# EasyEDA Pro project ProProject_AmaizeTrack.epro, board AmaizePCB_2
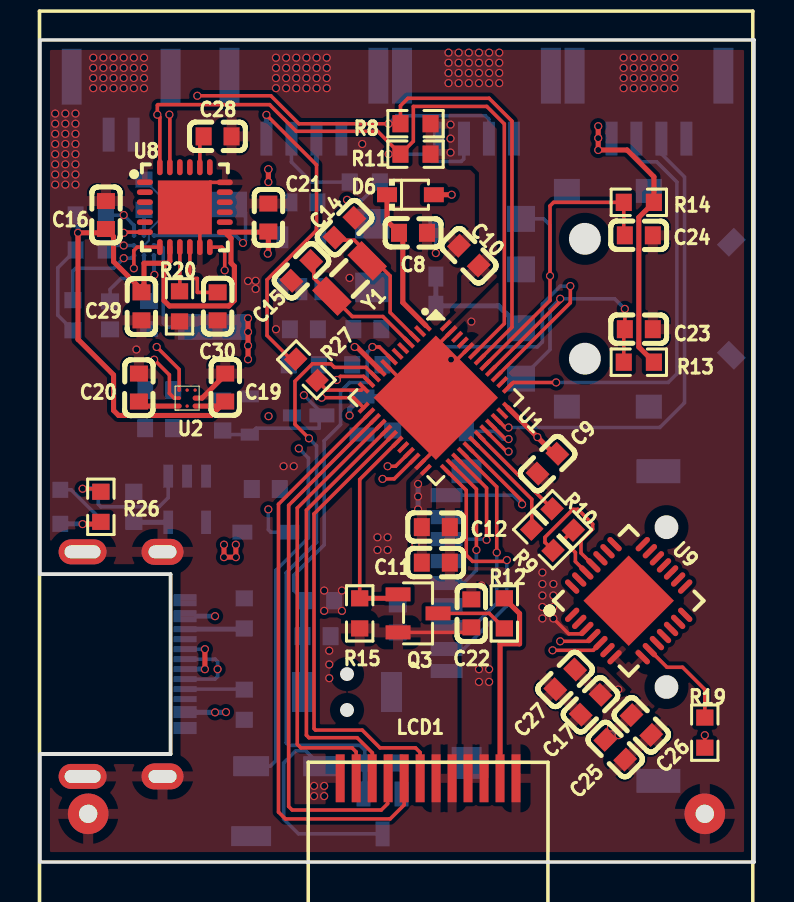
[diagram p6: board, top side]
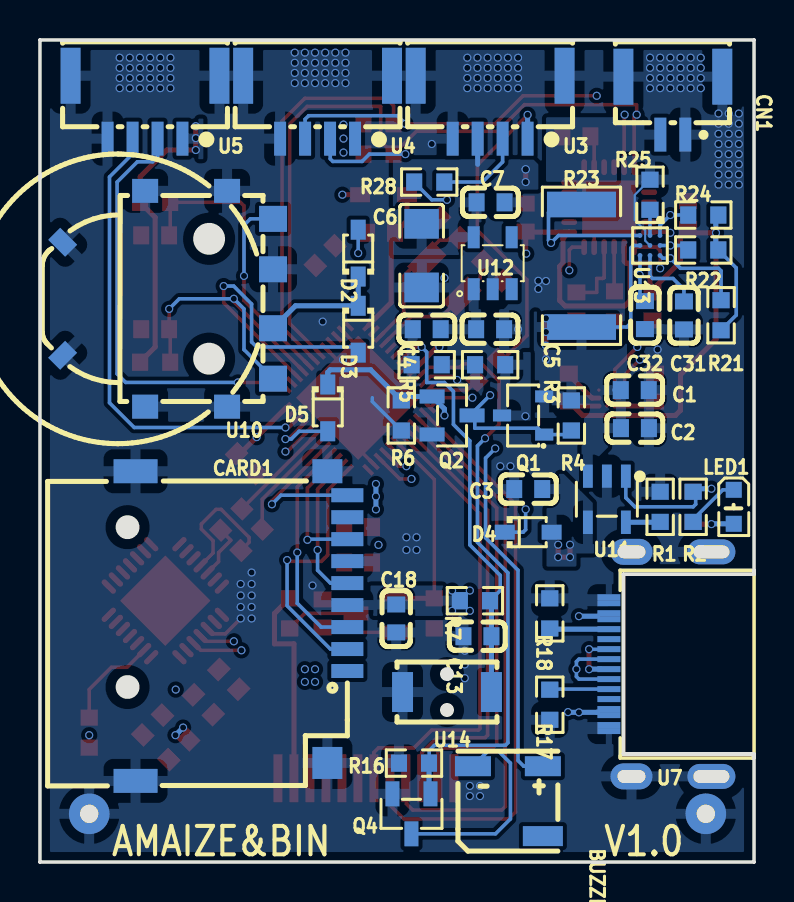
[diagram p7: board, bottom side, seen from below]

Outline 35.74 x 41.15 mm; copper layers: Top Layer, Inner1, Inner2, Bottom Layer. Coordinates in mm from the lower left corner of the outline.
Outline path: 0,41.15 0,14.41 6.54,14.41 6.54,5.41 0,5.41 0,0 35.74,0 35.74,41.15 0,41.15
Stack: Top Layer 0.035mm 外层铜厚1oz / Dielectric1 0.2104mm 7628 RC49% 8.6mil / Inner1 0.0152mm 内层铜厚 / Dielectric2 1.065mm 1.1mm H/HOZ 含铜 / Inner2 0.0152mm 内层铜厚 / Dielectric3 0.2104mm 7628 RC49% 8.6mil / Bottom Layer 0.035mm 外层铜厚1oz

## Design rules (mm)
template: 自定义配置
spacing copperThickness1oz (default): track to track 0.102, other pairs 0.051 to 0.3
spacing copperThickness2oz: track to track 0.203, other pairs 0.152 to 0.3
spacing copperThicknessInner0.5oz: track to track 0.089, other pairs 0.152 to 0.3
track width copperThickness1oz (default): min 0.102, default 0.254, max 2.54
track width copperThickness2oz: min 0.203, default 0.254, max 2.54
track width copperThickness0.5oz: min 0.089, default 0.254, max 2.54
differential pair differentialPair (default): width min 0.127, default 0.254, max 2.54; gap min 0.152, default 0.152
via viaSize (default): diameter min 0.3, default 0.61, max 10; hole min 0.201, default 0.305, max 6.299
net GND uses copperRegion1
net 3V3 uses copperRegion1
net BAT_IN uses copperRegion1
net BAT uses copperRegion1
net USB_VCC uses copperRegion1
net V33_CP2102 uses copperRegion1
net BAT_PACK+ uses copperRegion1

## Placement (name value [footprint] x y rotation side)
BUZZER1  4kHz  [BUZ-SMD_FST-5030]  12.32 3.05 0 bottom
C1  4.7uF  [C0603]  5.97 23.62 180 bottom
C2  100nF  [C0603]  5.96 21.72 180 bottom
C3  4.7uF  [C0603]  11.3 18.67 0 bottom
C4  100nF  [C0603]  16.38 26.67 0 bottom
C5  10uF  [C0603]  13.21 26.67 180 bottom
C6  22uF  [C1206]  16.64 30.35 270 bottom
C7  100nF  [C0603]  13.19 33.02 180 bottom
C8  100nF  [C0603]  18.67 31.5 180 top
C9  1uF  [C0603]  25.4 19.94 225 top
C10  1uF  [C0603]  21.46 30.35 135 top
C11  1uF  [C0603]  19.81 14.99 0 top
C12  1uF  [C0603]  19.81 16.76 0 top
C13  100nF  [C0603]  13.84 11.3 180 bottom
C14  22pF  [C0603]  15.24 31.75 225 top
C15  22pF  [C0603]  13.08 29.59 225 top
C16  1uF  [C0603]  3.3 32.39 270 top
C17  4.7uF  [C0603]  27.56 7.87 45 top
C18  100nF  [C0603]  17.91 12.19 90 bottom
C19  2.2uF  [C0603]  9.27 23.75 270 top
C20  4.7uF  [C0603]  4.95 23.75 90 top
C21  100nF  [C0603]  11.43 32.26 270 top
C22  100nF  [C0603]  21.59 12.45 90 top
C23  100nF  [C0603]  29.97 26.67 0 top
C24  100nF  [C0603]  29.97 31.37 0 top
C25  1uF  [C0603]  28.79 5.62 315 top
C26  100nF  [C0603]  30.1 6.86 315 top
C27  100nF  [C0603]  26.29 9.14 45 top
C28  2.2nF  [C0603]  8.89 36.32 0 top
C29  10nF  [C0603]  5.08 27.81 90 top
C30  100nF  [C0603]  8.89 27.81 270 top
C31  2.2uF  [C0603]  3.51 27.36 270 bottom
C32  1uF  [C0603]  5.46 27.38 90 bottom
CARD1  TF PUSH  [TF-SMD_TF-PUSH]  25.65 11.81 270 bottom
CN1  WAFER-GH1.25-2PWB  [CONN-TH_2P-P1.25_XUNPU_WAFER-GH1.25-2PWB]  4.06 37.86 0 bottom
D2  1N4148WS  [SOD-323_L1.8-W1.3-LS2.5-RD]  19.81 30.48 90 bottom
D3  1N4148WS  [SOD-323_L1.8-W1.3-LS2.5-RD]  19.81 26.67 270 bottom
D4  1N4148WS  [SOD-323_L1.8-W1.3-LS2.5-RD]  11.3 16.51 180 bottom
D5  1N4148WS  [SOD-323_L1.8-W1.3-LS2.5-RD]  21.34 22.73 270 bottom
D6  1N4007WS  [SOD-323_L1.8-W1.3-LS2.5-RD]  18.54 33.4 0 top
LCD1  SCREEN 2.0'  [SCREEN 2.0' 12PIN]  19.43 2.99 0 top
LED1  SZYY0603R  [LED0603-R-RD]  1.02 17.78 270 bottom
NOREF  -  [Pad_e650]  2.41 2.41 0 top
NOREF#2  -  [Pad_e649]  33.27 2.41 0 top
Q1  AO3401  [SOT-23-3_L2.9-W1.4-P1.90-LS2.6-BR]  11.56 22.35 180 bottom
Q2  AO3400  [SOT-23-3_L2.9-W1.3-P1.90-LS2.4-BR]  15.11 22.35 0 bottom
Q3  AO3400  [SOT-23-3_L2.9-W1.3-P1.90-LS2.4-BR]  18.92 12.45 180 top
Q4  AO3400  [SOT-23-3_L2.9-W1.3-P1.90-LS2.4-BR]  17.15 2.41 90 bottom
R1  2kΩ  [R0603]  4.7 17.78 90 bottom
R2  1kΩ  [R0603]  3.05 17.78 90 bottom
R3  20kΩ  [R0603]  13.21 24.89 0 bottom
R4  20kΩ  [R0603]  9.14 22.35 270 bottom
R5  20kΩ  [R0603]  16.38 24.89 0 bottom
R6  20kΩ  [R0603]  17.65 22.35 90 bottom
R7  10kΩ  [R0603]  13.97 13.08 180 bottom
R8  10kΩ  [R0603]  18.8 36.96 180 top
R9  100Ω  [R0603]  25.15 16.13 315 top
R10  100Ω  [R0603]  26.16 17.14 315 top
R11  10kΩ  [R0603]  18.8 35.43 180 top
R12  10Ω  [R0603]  23.24 12.45 270 top
R13  10kΩ  [R0603]  29.97 25.02 180 top
R14  10kΩ  [R0603]  29.97 33.02 180 top
R15  10kΩ  [R0603]  16 12.45 270 top
R16  10kΩ  [R0603]  17.02 4.95 0 bottom
R17  5.1kΩ  [R0603]  10.22 7.87 90 bottom
R18  5.1kΩ  [R0603]  10.22 12.45 270 bottom
R19  10kΩ  [R0603]  33.27 6.48 270 top
R20  10kΩ  [R0603]  6.99 27.81 90 top
R21  10kΩ  [R0603]  1.65 27.37 90 bottom
R22  10kΩ  [R0603]  2.54 30.64 0 bottom
R23  0Ω  [R2512]  8.64 29.84 270 bottom
R24  10kΩ  [R0603]  2.54 32.39 180 bottom
R25  SDNT1608X103F3380FTF  [R0603]  5.21 33.4 90 bottom
R26  10kΩ  [R0603]  3.05 17.78 90 top
R27  100Ω  [R0603]  13.34 24.64 315 top
R28  100Ω  [R0603]  16.26 34.04 0 bottom
U1  AT32F403ACGU7  [QFN-48_L6.0-W6.0-P0.40-BL-EP4.2]  19.81 23.24 225 top
U2  QMC6310U  [LGA-8_L1.2-W1.2-P0.40-R3-C3-TL]  7.37 23.22 180 top
U3  WAFER-GH1.25-4PWB  [CONN-SMD_4P-P1.25_XUNPU_WAFER-GH1.25-4PWB]  13.21 37.78 0 bottom
U4  WAFER-GH1.25-4PWB  [CONN-SMD_4P-P1.25_XUNPU_WAFER-GH1.25-4PWB]  21.84 37.78 0 bottom
U5  WAFER-GH1.25-4PWB  [CONN-SMD_4P-P1.25_XUNPU_WAFER-GH1.25-4PWB]  30.48 37.78 0 bottom
U7  USB-TYPE-C-016  [USB-SMD_TYPE-C16PCB1.6073]  4.7 9.91 90 bottom
U8  MPU-6050  [QFN-24_L4.0-W4.0-P0.50-BL-EP2.7]  7.25 32.78 270 top
U9  CP2102-GMR  [WQFN-28_L5.0-W5.0-P0.50-BL-EP3.2]  29.46 13.08 315 top
U10  SIQ-02FVS3  [SW-SMD_SIQ-02FVS3_1]  29.34 28.19 90 bottom
U11  MCP73831T-2ACI/OT  [SOT-23-5_L3.0-W1.7-P0.95-LS2.8-BL]  7.37 18.16 0 bottom
U12  LP5907MFX-3.3/NOPB  [SOT-23-5_L3.0-W1.7-P0.95-LS2.8-BR]  13.08 29.97 270 bottom
U13  BQ27220YZFR  [DSBGA-9_L1.7-W1.6-R3-C3-P0.50-BL]  5.21 30.86 0 bottom
U14  ZX-QC34-2TPDZ  [KEY-SMD_L3.9-W3.0-LS5.0-EH]  15.37 8.51 180 bottom
Y1  32.768kHz  [FC-135R_L3.2-W1.5]  15.49 29.21 225 top

## Footprints (pads in the part's own frame, mm; a bottom-side part is the same pattern mirrored in y, then rotated)
BUZ-SMD_FST-5030
  rect 1.8x1 smd: 1(-1.75,-1.75) 2(1.75,-1.75)
  rect 2x1 smd: 3(-1.75,1.75)
C0603
  rect 0.8x0.9 smd: 1(-0.7,0) 2(0.7,0)
C1206
  rect 1.485x1.728 smd: 1(-1.593,0) 2(1.593,0)
CONN-SMD_4P-P1.25_XUNPU_WAFER-GH1.25-4PWB
  rect 0.6x1.7 smd: 1(1.875,1.575) 2(0.625,1.575) 3(-0.625,1.575) 4(-1.875,1.575)
  rect 1x2.8 smd: 5(3.725,-1.575) 6(-3.725,-1.575)
CONN-TH_2P-P1.25_XUNPU_WAFER-GH1.25-2PWB
  rect 0.6x1.7 smd: 1(-0.625,1.45) 2(0.625,1.45)
  rect 1x2.8 smd: 3(-2.475,-1.45) 4(2.475,-1.45)
DSBGA-9_L1.7-W1.6-R3-C3-P0.50-BL
  round 0.24 smd: A1(-0.5,-0.5) A2(-0.5,0) A3(-0.5,0.5) B1(0,-0.5) B2(0,0) B3(0,0.5) C1(0.5,-0.5) C2(0.5,0) C3(0.5,0.5)
FC-135R_L3.2-W1.5
  rect 1x1.8 smd: 1(-1.25,0) 2(1.25,0)
KEY-SMD_L3.9-W3.0-LS5.0-EH
  rect 1.05x2 smd: 1(-2.225,0) 2(2.225,0)
LED0603-R-RD
  rect 0.8x0.8 smd: 1(0.851,0) 2(-0.851,0)
LGA-8_L1.2-W1.2-P0.40-R3-C3-TL
  round 0.17 smd: A1(-0.4,0.4) A2(0,0.4) A3(0.4,0.4) B1(-0.4,0) B3(0.4,0) C1(-0.4,-0.4) C2(0,-0.4) C3(0.4,-0.4)
Pad_e649
  round 2.032 hole 0.914: 50(0,0)
Pad_e650
  round 2.032 hole 0.914: 51(0,0)
QFN-24_L4.0-W4.0-P0.50-BL-EP2.7
  oval 0.28x0.8 smd: 1(-1.25,-2) 2(-0.75,-2) 3(-0.25,-2) 4(0.25,-2) 5(0.75,-2) 6(1.25,-2) 13(1.25,2) 14(0.75,2) 15(0.25,2) 16(-0.25,2) 17(-0.75,2) 18(-1.242,2)
  oval 0.8x0.28 smd: 7(2,-1.25) 8(2,-0.75) 9(2,-0.25) 10(2,0.25) 11(2,0.75) 12(2,1.25) 19(-2,1.25) 20(-2,0.75) 21(-2,0.25) 22(-2,-0.25) 23(-2,-0.75) 24(-2,-1.25)
  rect 2.7x2.7 smd: 25(0.013,0)
QFN-48_L6.0-W6.0-P0.40-BL-EP4.2
  rect 0.2x0.665 smd: 1(-2.2,-2.908) 2(-1.8,-2.908) 3(-1.4,-2.907) 4(-1,-2.908) 5(-0.6,-2.908) 6(-0.2,-2.908) 7(0.2,-2.908) 8(0.6,-2.908) 9(1,-2.908) 10(1.4,-2.907) 11(1.8,-2.908) 12(2.2,-2.908) 25(2.2,2.908) 26(1.8,2.908) 27(1.4,2.907) 28(1,2.908) 29(0.6,2.908) 30(0.2,2.908) 31(-0.2,2.908) 32(-0.6,2.908) 33(-1,2.908) 34(-1.4,2.907) 35(-1.8,2.908) 36(-2.2,2.908)
  rect 0.665x0.2 smd: 13(2.908,-2.2) 14(2.908,-1.8) 15(2.907,-1.4) 16(2.908,-1) 17(2.908,-0.6) 18(2.908,-0.2) 19(2.908,0.2) 20(2.908,0.6) 21(2.908,1) 22(2.907,1.4) 23(2.908,1.8) 24(2.908,2.2) 37(-2.908,2.2) 38(-2.908,1.8) 39(-2.907,1.4) 40(-2.908,1) 41(-2.908,0.6) 42(-2.908,0.2) 43(-2.908,-0.2) 44(-2.908,-0.6) 45(-2.908,-1) 46(-2.907,-1.4) 47(-2.908,-1.8) 48(-2.908,-2.2)
  rect 4.4x4.4 smd: 49(0,0)
R0603
  rect 0.806x0.864 smd: 1(-0.753,0) 2(0.753,0)
R2512
  rect 1.282x3.456 smd: 1(-3.067,0) 2(3.067,0)
SCREEN 2.0' 12PIN
  rect 0.45x2.4 smd: 1(4.4,1.2) 2(3.6,1.2) 3(2.8,1.2) 4(2,1.2) 5(1.2,1.2) 6(0.4,1.2) 7(-0.4,1.2) 8(-1.2,1.2) 9(-2,1.2) 10(-2.8,1.2) 11(-3.6,1.2) 12(-4.4,1.2)
SOD-323_L1.8-W1.3-LS2.5-RD
  rect 1x0.75 smd: 1(-1.173,0) 2(1.173,0)
SOT-23-3_L2.9-W1.3-P1.90-LS2.4-BR
  rect 1.25x0.7 smd: 1(1,-0.95) 2(1,0.95) 3(-1,0)
SOT-23-3_L2.9-W1.4-P1.90-LS2.6-BR
  rect 0.91x0.6 smd: 1(1.055,-0.955) 2(1.055,0.955) 3(-1.055,0)
SOT-23-5_L3.0-W1.7-P0.95-LS2.8-BL
  rect 0.49x1.157 smd: 1(-0.95,-1.153) 2(0,-1.153) 3(0.95,-1.153)
  rect 0.49x1.175 smd: 4(0.95,1.153) 5(-0.95,1.153)
SOT-23-5_L3.0-W1.7-P0.95-LS2.8-BR
  rect 1.1x0.6 smd: 1(1.3,-0.95) 2(1.3,0) 3(1.3,0.95) 4(-1.3,0.95) 5(-1.3,-0.95)
SW-SMD_SIQ-02FVS3_1
  rect 1.2x1.3 smd: 1(5.4,-2.964) 2(5.4,1.136) 5(-5.4,1.136) 6(-5.4,-2.964)
  rect 0.85x1.2 smd rot 45: 3(2.829,5.264)
  rect 0.85x1.2 smd rot 135: 4(-2.829,5.264)
  rect 1.3x1.4 smd: A(-4,-5.264) B(4,-5.264) C(1.475,-5.264) S(-1.475,-5.264)
TF-SMD_TF-PUSH
  rect 0.7x1.6 smd: 1(2.25,5.3) 2(1.15,5.3) 3(0.05,5.3) 4(-1.05,5.3) 5(-2.15,5.3) 6(-3.25,5.3) 7(-4.35,5.3) 8(-5.45,5.3) 9(-6.55,5.3)
  rect 1.2x1.5 smd: 10(-7.75,4.3)
  rect 1.2x2.2 smd: 11(-7.75,-5.3) 12(7.75,-5.3)
  rect 1.6x1.5 smd: 13(6.85,4.3)
USB-SMD_TYPE-C16PCB1.6073
  oval 1.25x2.4 hole 0.65x1.8: 17(-5.62,-2.566) 18(5.62,-2.566)
  oval 1.3x2.1 hole 0.65x1.4: 19(-5.62,1.435) 20(5.62,1.435)
  rect 0.3x1.15 smd: A1(-3.35,2.566) A4(-2.55,2.566) A5(-1.25,2.566) A6(-0.25,2.566) A7(0.25,2.566) A8(1.25,2.566) A9(2.55,2.566) A12(3.35,2.566) B1(3.05,2.566) B4(2.25,2.566) B5(1.75,2.566) B6(0.75,2.566) B7(-0.75,2.566) B8(-1.75,2.566) B9(-2.25,2.566) B12(-3.05,2.566)
WQFN-28_L5.0-W5.0-P0.50-BL-EP3.2
  oval 0.28x0.9 smd: 1(-1.502,-2.5) 2(-1.001,-2.5) 3(-0.5,-2.5) 4(0,-2.5) 5(0.5,-2.5) 6(1,-2.5) 7(1.501,-2.5) 15(1.501,2.5) 16(1,2.5) 17(0.5,2.5) 18(0,2.5) 19(-0.5,2.5) 20(-1.001,2.5) 21(-1.502,2.5)
  oval 0.9x0.28 smd: 8(2.5,-1.502) 9(2.5,-1.001) 10(2.5,-0.5) 11(2.5,0) 12(2.5,0.5) 13(2.5,1) 14(2.5,1.501) 22(-2.5,1.501) 23(-2.5,1) 24(-2.5,0.5) 25(-2.5,0) 26(-2.5,-0.5) 27(-2.5,-1.001) 28(-2.5,-1.502)
  rect 3.2x3.2 smd: 29(0,0)

## Nets
As in the schematic, except:
GND: C1.2 C2.2 C3.2 C4.2 C5.2 C6.2 C7.2 C8.1 C9.2 C10.2 C11.2 C12.2 C13.1 C14.1 C15.2 C16.1 C17.1 C18.1 C19.1 C20.2 C21.1 C22.1 C23.2 C24.2 C25.2 C26.2 C27.1 C28.2 C29.1 C30.2 C31.2 C32.1 CARD1.6 CARD1.10 CARD1.11 CARD1.12 CARD1.13 CN1.1 CN1.3 CN1.4 LCD1.1 LCD1.5 LCD1.6 LCD1.12 NOREF.51 NOREF#2.50 Q2.2 Q3.2 Q4.2 R1.2 R5.2 R6.1 R15.2 R16.2 R17.1 R18.1 R20.1 R25.2 U1.8 U1.23 U1.35 U1.44 U1.47 U1.49 U2.B1 U3.1 U3.5 U3.6 U4.1 U4.5 U4.6 U5.1 U5.5 U5.6 U7.17 U7.18 U7.19 U7.20 U7.A1 U7.A12 U7.B1 U7.B12 U8.1 U8.11 U8.18 U8.25 U9.3 U9.29 U10.1 U10.2 U10.3 U10.4 U10.5 U10.6 U10.C U11.2 U12.2 U13.B2 U14.1

Pads without a net: BUZZER1 3; CARD1 1 8; U1 2 5 6 20 38 45 46; U2 A2 C1 C2; U7 A8 B8; U8 2 3 4 5 14 15 16 17 19 21 22; U9 1 2 10 11 12 13 14 15 16 17 18 19 20 21 22 23 24 27 28; U12 4

## Via types
v1: diameter 0.406, hole 0.299, Top Layer to Bottom Layer, 242 vias

## Routing (per net, layer and track width the routed paths; a pad name or vN(x,y) marks a point on that pad's centre or on a via; arc(x,y) is an arc through that point)
3V3: length 97.1
  Top Layer w0.254: 5.08,28.65 5.08,28.78 5.21,28.91 5.21,29.97 6.21,29.97 ; 5.08,28.65 3.68,30.05 3.68,31.3 C16.2 3.11,31.5 v1(1.91,31.5) 1.91,26.16 3.68,24.38 3.68,22.61 3.94,22.35 8.57,22.35 9.05,22.82 ; 5.08,28.65 C29.2 ; 7.77,22.82 9.05,22.82 ; 9.05,22.82 C19.2 ; R13.1 30.73,25.03 29.97,25.78 29.97,32.27 R14.1 30.73,34.3 29.38,35.64 v1(27.94,35.64) v1(27.94,36.23) v1(27.94,36.83) ; U1.9 15.86,25.78 v1(15.75,25.78) ; U8.8 6.5,30.08 6.4,29.97 6.21,29.97 ; U1.36 v1(24.9,21.27) 25.73,20.43 C9.1 ; v1(11.4,30.45) 11.43,30.48 C21.2 11.4,31.53 U8.13 9.56,31.22 9.56,29.98 9.73,29.82 9.73,28.11 9.46,27.83 6.48,27.83 6.21,28.1 6.21,29.97 ; v1(11.43,34.67) v1(11.43,34.04)
  Inner1 w0.254: v1(11.43,34.04) 11.43,30.48 v1(11.4,30.45) ; v1(24.9,21.27) 22.55,18.92 v1(18.92,18.92) ; v1(20.55,36.91) 19.61,37.85 14.6,37.85 v1(11.43,34.67)
  Inner2 w0.254: v1(15.75,25.78) 15.75,25.4 18.92,22.22 v1(18.92,18.92)
  Bottom Layer w0.178: R21.1 0.89,27.38 0.89,29.74 R22.1
  Bottom Layer w0.254: v1(18.92,17.65) v1(18.92,18.3) v1(18.92,18.92) ; 1.91,32.39 1.91,30.64 ; U3.2 13.83,34.92
  vias: v1(14.22,13.59) v1(14.22,12.57) v1(15.11,13.59) v1(15.11,12.57) v1(18.8,15.88) v1(20.55,36.21) v1(20.55,35.51) v1(21.97,9.65) v1(21.97,9.02) v1(22.1,13.84) v1(22.48,9.65) v1(22.48,9.02)
GND: length 31.6
  Top Layer w0.178: U1.47 19.81,25.79 19.81,24.09 ; Q3.2 21.34,11.5 C22.1 ; 21.44,25.72 19.81,24.09 ; 19.81,24.09 U1.49 ; U8.11 8,32.02 U8.25 8.51,34.02 U8.18 ; U1.49 18.96,23.24 17.33,24.87 ; U1.49 19.81,20.7 U1.23 ; U9.3 27.1,11.42 26.47,11.42 v1(25.69,12.19)
  Top Layer w0.254: 7.77,23.22 8.11,23.22 9.27,24.38 C19.1
  Bottom Layer w0.102: R25.2 5.97,33.39 5.97,32.13 5.45,31.61 5.45,31.1 U13.B2
  Bottom Layer w0.178: 19.1,23.24 19.1,23.05 R6.1
  vias: v1(0.76,37.47) v1(0.76,36.96) v1(0.76,36.45) v1(0.76,35.94) v1(0.76,35.43) v1(0.76,34.92) v1(0.76,34.42) v1(0.76,33.91) v1(1.27,37.47) v1(1.27,36.96) v1(1.27,36.45) v1(1.27,35.94) v1(1.27,35.43) v1(1.27,34.92) v1(1.27,34.42) v1(1.27,33.91) v1(1.78,37.47) v1(1.78,36.96) v1(1.78,36.45) v1(1.78,35.94) v1(1.78,35.43) v1(1.78,34.92) v1(1.78,34.42) v1(1.78,33.91) v1(2.67,40.26) v1(2.67,39.75) v1(2.67,39.24) v1(2.67,38.73) v1(3.18,40.26) v1(3.18,39.75) v1(3.18,39.24) v1(3.18,38.73) v1(3.68,40.26) v1(3.68,39.75) v1(3.68,39.24) v1(3.68,38.73) v1(4.19,40.26) v1(4.19,39.75) v1(4.19,39.24) v1(4.19,38.73) v1(4.7,40.26) v1(4.7,39.75) v1(4.7,39.24) v1(4.7,38.73) v1(4.83,25.65) v1(5.21,40.26) v1(5.21,39.75) v1(5.21,39.24) v1(5.21,38.73) v1(10.41,29.08) v1(10.8,29.09) v1(10.8,28.69) v1(11.81,40.26) v1(11.81,39.75) v1(11.81,39.24) v1(11.81,38.73) v1(11.81,26.67) v1(12.19,19.81) v1(12.32,40.26) v1(12.32,39.75) v1(12.32,39.24) v1(12.32,38.73) v1(12.7,19.81) v1(12.83,40.26) v1(12.83,39.75) v1(12.83,39.24) v1(12.83,38.73) v1(13.34,40.26) v1(13.34,39.75) v1(13.34,39.24) v1(13.34,38.73) v1(13.72,3.81) v1(13.72,3.3) v1(13.84,40.26) v1(13.84,39.75) v1(13.84,39.24) v1(13.84,38.73) v1(14.22,3.81) v1(14.22,3.3) v1(14.35,40.26) v1(14.35,39.75) v1(14.35,39.24) v1(14.35,38.73) v1(14.48,10.58) v1(14.48,9.89) v1(14.48,9.2) v1(15.49,29.24) v1(16.13,35.94) v1(16.89,16.26) v1(16.89,15.62) v1(17.4,16.26) v1(17.4,15.62) v1(20.45,40.51) v1(20.45,40) v1(20.45,39.5) v1(20.45,38.99) v1(20.57,25.15) v1(20.96,40.51) v1(20.96,40) v1(20.96,39.5) v1(20.96,38.99) v1(21.46,40.51) v1(21.46,40) v1(21.46,39.5) v1(21.46,38.99) v1(21.59,27.05) v1(21.97,40.51) v1(21.97,40) v1(21.97,39.5) v1(21.97,38.99) v1(22.48,40.51) v1(22.48,40) v1(22.48,39.5) v1(22.48,38.99) v1(22.99,40.51) v1(22.99,40) v1(22.99,39.5) v1(22.99,38.99) v1(25.15,14.49) v1(25.15,13.92) v1(25.15,13.34) v1(25.15,12.77) v1(25.15,12.19) v1(25.69,13.92) v1(25.69,13.34) v1(25.69,12.77) v1(29.21,40.26) v1(29.21,39.75) v1(29.21,39.24) v1(29.21,38.73) v1(29.72,40.26) v1(29.72,39.75) v1(29.72,39.24) v1(29.72,38.73) v1(30.23,40.26) v1(30.23,39.75) v1(30.23,39.24) v1(30.23,38.73) v1(30.73,40.26) v1(30.73,39.75) v1(30.73,39.24) v1(30.73,38.73) v1(31.24,40.26) v1(31.24,39.75) v1(31.24,39.24) v1(31.24,38.73) v1(31.75,40.26) v1(31.75,39.75) v1(31.75,39.24) v1(31.75,38.73)
V33_CP2102: length 5.9
  Top Layer w0.178: v1(33.27,6.35) R19.2
  Inner2 w0.178: v1(33.27,6.35) 31.23,6.35 v1(28.94,8.63)
VBAT: length 7.4
  Top Layer w0.254: U1.1 18.16,28 18.16,31.3 C8.2 17.37,32.1 D6.1
VDD_GAUGE: length 3.6
  Bottom Layer w0.178: U13.B3 5.21,29.34 5.08,29.21 4.06,29.21 3.51,28.66 C31.1
AUX_CL: length 11.6
  Top Layer w0.178: U2.B3 6.71,23.22 6.48,23.46 6.48,24.38 v1(5.72,25.15) ; v1(4.7,29.72) 4.7,30.61 4.87,30.78 U8.7
  Inner1 w0.178: v1(5.72,25.15) 6.48,25.15 6.6,25.27 6.6,25.65 4.06,28.19 4.06,29.08 v1(4.7,29.72)
AUX_DA: length 10.5
  Top Layer w0.178: v1(4.19,31.5) 4.22,31.53 U8.6 ; U2.C3 6.97,24.66 v1(5.84,25.78)
  Inner1 w0.178: v1(5.84,25.78) 3.68,27.94 3.68,30.99 v1(4.19,31.5)
BAT: length 20.1
  Inner1 w0.178: v1(12.95,20.7) 12.95,20.8 v1(11.44,22.32)
  Bottom Layer w0.178: BUZZER1.1 11.53,4.8 11.81,5.08 11.81,14.61 13.44,16.23 13.44,20.22 v1(12.95,20.7)
BAT_CHG_DET: length 32.7
  Top Layer w0.178: R26.2 2.9,18.69 v1(2.13,18.69) ; U1.32 23.36,20.54 23.49,20.54
  Inner1 w0.178: v1(23.45,20.54) 22.38,19.47 18.71,19.47 15.84,16.6 4.22,16.6 v1(2.13,18.69)
  Bottom Layer w0.178: U11.1 6.42,18.23 5.96,17.78 3.05,17.78 2.92,17.91 2.92,18.53
  Bottom Layer w0.254: v1(2.13,18.69) 2.77,18.69 2.92,18.53
BAT_DET: length 1.8
  Top Layer w0.178: v1(14.86,24.13) 15.04,24.31 16.2,24.31 U1.11
BAT_IN: length 26.4
  Top Layer w0.254: v1(10.41,25.17) v1(10.41,25.85) v1(10.41,26.53) v1(10.41,27.22) ; D6.2 v1(20.6,33.4)
  Inner2 w0.178: v1(10.41,27.22) 20.23,27.22 20.57,27.56 20.57,33.37 v1(20.6,33.4)
  Bottom Layer w0.178: R23.2 6.37,26.78 6.17,26.98 6.17,30.73 6.04,30.86 U13.C2
  Bottom Layer w0.254: 6.97,23.62 6.66,23.31
BAT_PACK+: length 15.5
  Inner1 w0.178: v1(5.73,29.39) 7.8,29.39 9.4,30.99 v1(10.16,30.99)
  Bottom Layer w0.178: U13.C3 5.71,28.32 C32.2 ; U13.C1 9.79,31.36 v1(10.16,30.99) 10.29,31.11 10.29,32.51 9.89,32.91 R23.1
BUZZ: length 30.1
  Top Layer w0.178: 16.77,24.31 16.31,24.76 14.74,24.76 14.56,24.94 13.63,24.94 12.76,24.07 12.76,21.91 v1(13.46,21.21)
  Bottom Layer w0.178: v1(13.46,21.21) 13.84,20.83 13.84,16 12.32,14.48 12.32,5.97 12.45,5.84 16,5.84 16.26,5.59 16.26,4.96 R16.1
  Bottom Layer w0.254: Q4.1 16.26,3.48 R16.1
D+: length 25.3
  Top Layer w0.178: U9.4 27.43,11.05 v1(26.03,11.05)
  Top Layer w0.254: v1(8.25,9.65) v1(8.25,10.66)
  Inner1 w0.178: v1(8.25,10.66) 8.5,10.41 11.43,10.41 15.24,6.6 20.7,6.6 25.15,11.05 v1(26.03,11.05)
  Bottom Layer w0.178: v1(8.25,10.66) 8.25,10.65 7.65,10.65 7.65,10.66
  Bottom Layer w0.254: 7.65,9.66 8.25,9.66 v1(8.25,9.65)
D-: length 26.1
  Top Layer w0.178: 28.05,10.96 27.69,10.6 v1(25.65,10.6)
  Inner1 w0.178: v1(8.89,9.65) 9.14,9.91 11.18,9.91 14.86,6.22 21.03,6.22 25.4,10.6 v1(25.65,10.6)
  Bottom Layer w0.178: 7.65,9.16 8.76,9.16 8.89,9.28 v1(8.89,9.65) 8.89,10.03 8.76,10.16 7.65,10.16
EC_A: length 15.9
  Top Layer w0.178: v1(26.03,28.19) 26.03,28.05 U1.40 ; R13.2 29.22,26.62 C23.1 29.27,27.69
  Bottom Layer w0.178: v1(29.27,27.69) 28.76,28.19 v1(26.03,28.19) 25.53,27.69 25.53,25.65 24.32,24.45 24.07,24.45
EC_B: length 18.9
  Top Layer w0.178: C24.1 29.22,31.42 R14.2 25.71,33.02 25.53,32.84 v1(25.53,29.34) 25.53,28.11 U1.41
  Bottom Layer w0.178: U10.B 25.21,32.19 25.53,31.88 25.53,29.32
EC_KEY: length 6.2
  Bottom Layer w0.254: U10.S 22.95,27.84 D3.1 D2.1
EC_KEY_DET: length 15.3
  Top Layer w0.178: v1(26.54,28.83) 26.54,27.99 22.86,24.31
  Bottom Layer w0.178: v1(26.54,28.83) 26.04,28.83 25.15,27.93 25.15,26.03 24.89,25.78 20.1,25.78 D3.2
GAUGE_INT: length 27.4
  Top Layer w0.178: 18.75,20.2 17.73,19.18 v1(17.15,19.18)
  Inner1 w0.178: v1(4.19,32.39) 4.19,32.12 3.3,31.24 3.3,26.16 10.29,19.18 v1(17.15,19.18)
  Bottom Layer w0.178: 3.42,32.39 4.2,32.39 4.2,32.38 4.71,31.87 U13.A1
GPS_RX: length 2.6
  Top Layer w0.178: U1.12 16.08,23.62 14.35,23.62 R27.2
GPS_TX: length 14.8
  Top Layer w0.178: U1.13 15.7,23.24 v1(14.1,23.24)
  Inner1 w0.178: v1(14.1,23.24) 14.1,31.88 v1(15.37,33.15)
  Bottom Layer w0.178: R28.2 17.01,34.03 16.13,33.15 v1(15.37,33.15)
IMU_INT1: length 17.8
  Top Layer w0.178: U1.21 17.8,19.81 v1(17.4,19.81) ; v1(9.25,29.62) 9.25,30.63 9.1,30.78 U8.12
  Inner1 w0.178: v1(17.4,19.81) 15.14,22.07 14.55,21.49 14.07,21.49 11.05,24.51 11.05,27.56 9.27,29.34 9.27,29.59 v1(9.25,29.62)
MCU_RX: length 5.2
  Top Layer w0.178: U1.31 22.01,21.3 25.5,17.8 25.76,17.8
MCU_SCL: length 53.9
  Top Layer w0.178: U8.23 6.5,37.38 v1(6.48,37.41) ; U1.42 23.62,26.77 23.62,37.08 22.48,38.23 18.41,38.23 18.04,37.85 R8.2 18.04,36.95 v1(17.45,36.95) 12.96,36.95 11.56,38.35 v1(7.87,38.35)
  Inner1 w0.178: v1(7.87,38.35) 7.42,38.35 v1(6.48,37.41) 6.48,32.52 4.32,30.36
  Bottom Layer w0.178: R21.2 1.65,29.59 1.78,29.72 3.68,29.72 v1(4.19,30.23) 4.57,30.23 U13.A3 ; v1(17.45,36.95) 17.85,37.36 22.29,37.36 22.47,37.18 U4.2
MCU_SDA: length 49.7
  Top Layer w0.178: U8.24 6,37.28 v1(5.88,37.41) 5.88,37.88 5.91,37.91 11.49,37.91 12.83,36.58 16.9,36.58 R11.2 18.69,36.08 18.69,37.82 22.36,37.82 23.24,36.94 23.24,26.95 U1.43
  Inner1 w0.178: v1(5.88,37.41) 5.88,32.55 4.18,30.86
  Bottom Layer w0.178: 3.42,30.64 3.65,30.86 v1(4.19,30.86) U13.A2 ; U4.3 21.21,36.2 21.21,35.2 21.08,35.07 19.62,35.07 19.25,35.43 v1(17.45,35.43)
MCU_TX: length 5.6
  Top Layer w0.178: R9.1 24.61,18.16 U1.30
OSC32_IN: length 7.2
  Top Layer w0.178: 18.75,26.29 17.53,27.51 17.53,29.34 15.74,31.13 14.62,31.13
OSC32_OUT: length 7.1
  Top Layer w0.178: 13.7,30.21 13.7,29.23 15.63,27.31 17.16,27.31 U1.4
PWR_EN: length 3.5
  Top Layer w0.178: U1.33 23.3,21.17 v1(23.45,21.17)
  Bottom Layer w0.178: v1(23.45,21.17) 23.16,21.17 22.77,21.56 D5.2
RST: length 21
  Top Layer w0.178: v1(16.64,25.78) 16.99,25.78 U1.7
  Bottom Layer w0.178: v1(16.64,25.78) 16.38,25.53 16.38,24 15.49,24 15.04,23.55 15.04,21.9 14.22,21.08 14.22,15.88 12.7,14.35 12.7,13.6 R7.2
  Bottom Layer w0.254: U14.2 13.14,11.17 13.27,11.3 13.14,11.43 13.14,13.01 R7.2
SCR_BLK: length 10.6
  Top Layer w0.178: R15.1 16,19.15 U1.19
  Top Layer w0.254: Q3.1 17.73,13.2 R15.1
SCR_CS: length 29.9
  Top Layer w0.178: 18.23,4.19 18.23,2.86 17.53,2.16 12.28,2.16 11.94,2.5 11.94,17.91 U1.14
SCR_DC: length 23.3
  Top Layer w0.178: U1.18 13.72,17.43 13.72,6.68 13.79,6.6 16.13,6.6 17.02,5.72 18.8,5.72 19.03,5.48 19.03,4.27
SCR_LEDK: length 10.3
  Top Layer w0.254: LCD1.2 23.03,10.92 24,10.92 24,12.44 R12.1
SCR_RES: length 22.2
  Top Layer w0.178: U1.16 12.88,17.72 12.88,5.89 13.06,5.72 15.62,5.72 15.83,5.51 15.83,4.19
SCR_SCL: length 27.4
  Top Layer w0.178: 17.43,3.99 17.4,3.96 17.4,2.92 17.08,2.6 12.62,2.6 12.45,2.78 12.45,17.86 16.77,22.17
SCR_SDA: length 22.1
  Top Layer w0.178: 16.63,3.99 16.64,4 16.64,5.46 15.88,6.22 13.46,6.22 13.34,6.35 13.34,17.61 17.33,21.61
SD_CD: length 8.2
  Top Layer w0.178: U1.29 24.13,18.07 v1(24.13,17.91)
  Bottom Layer w0.178: 20.1,18.36 23.68,18.36 v1(24.13,17.91)
SD_CS: length 13.3
  Top Layer w0.178: v1(23.37,15.11) 23.3,15.05 21.65,15.05 21.34,15.37 21.34,18.61 U1.25
  Bottom Layer w0.178: 20.1,10.66 21.2,10.66 23.37,12.83 v1(23.37,15.11)
SD_MISO: length 6.9
  Top Layer w0.178: v1(22.35,16.13) 22.35,18.72 U1.27
  Bottom Layer w0.178: 20.1,16.16 22.32,16.16 v1(22.35,16.13)
SD_MOSI: length 11.5
  Top Layer w0.178: U1.28 22.86,18.78 v1(22.86,15.49)
  Bottom Layer w0.178: v1(22.86,15.49) 22.86,12.95 21.67,11.76 20.1,11.76
SD_SCK: length 7.9
  Top Layer w0.178: U1.26 21.84,18.66 v1(21.84,15.62)
  Bottom Layer w0.178: 20.67,13.96 21.2,13.96 21.84,14.61 v1(21.84,15.62) ; 20.67,13.96 20.66,13.95 ; 20.67,13.96 20.1,13.96
SWCLK: length 21.9
  Top Layer w0.178: U1.37 23.69,24 25.78,24 25.83,24.05 v1(25.83,24.01)
  Bottom Layer w0.178: U5.3 29.85,35.3 30.1,35.05 30.86,35.05 31.88,34.04 31.88,24.44 31.45,24.01 v1(25.83,24.01)
SWDIO: length 23.8
  Top Layer w0.178: U1.34 23.28,21.75 v1(23.45,21.75)
  Bottom Layer w0.178: v1(23.45,21.75) 31.02,21.75 32.26,22.99 32.26,34.29 31.1,35.44 U5.2
USB_VCC: length 35.7
  Top Layer w0.254: v1(2.13,16.92) 2.94,16.92 R26.1 ; v1(9.21,15.88) v1(9.21,15.26) v1(9.8,15.26) v1(9.8,15.88)
  Inner2 w0.178: 9.27,7.51 11.7,5.08 27.69,5.08 v1(28.96,6.35)
  Inner2 w0.254: v1(2.13,16.92) 8.18,16.92 v1(9.21,15.88)
  Bottom Layer w0.254: v1(8.76,12.31) 7.84,12.31 ; v1(28.57,6.73) v1(28.96,6.35) ; 9.14,7.49 v1(8.76,7.49) 7.86,7.49 7.84,7.51 ; 1.02,17.18 LED1.1 2.12,16.93 v1(2.13,16.92)
  vias: v1(9.31,7.51)
$1N4620: length 2.1
  Top Layer w0.254: C20.1 5.18,22.82 6.97,22.82
$1N6394: length 3.6
  Top Layer w0.178: Q3.3 22.49,12.45 R12.2
$1N8215: length 1.6
  Top Layer w0.178: U8.20 8,36.13 8.19,36.32
$1N9459: length 5
  Top Layer w0.178: 30.52,10.61 31.38,9.75 32.16,9.75 33.27,8.64 R19.1
$1N9734: length 3
  Top Layer w0.178: 26.82,16.74 26.19,16.1 26.8,15.49 26.8,15.04 27.34,14.5
$1N9736: length 6.7
  Top Layer w0.178: R9.2 25.27,16 25.27,16.26 26.67,17.65 26.92,17.65 27.66,16.92 27.66,16.67 27.08,16.08 27.08,15.47 U9.25
$1N17722: length 3.6
  Top Layer w0.178: C30.1 7.87,28.51 7.87,29.21 7.57,29.21 7.53,29.25 7.5,29.25 U8.10
$1N17759: length 2.3
  Top Layer w0.178: U8.9 7,28.68 7.11,28.57
$1N48758: length 16.2
  Top Layer w0.178: v1(11.33,37.4) 13.84,34.89 13.84,31.62 11.37,29.15 11.37,26.35 12.55,25.17 R27.1
  Bottom Layer w0.254: v1(11.33,37.4) U3.4
$1N48760: length 4.5
  Bottom Layer w0.178: R28.1 13.59,34.04 12.58,35.04 U3.3
$2N665: length 19.9
  Inner1 w0.178: v1(13.21,23.37) 14.03,22.54 14.03,22.54 19.81,28.32 v1(19.81,30.48)
  Bottom Layer w0.178: D2.2 v1(19.81,30.48) ; 9.14,21.73 9.47,21.4 Q1.1 10.82,21.72 13.98,21.72 13.98,22.35 ; 13.98,22.35 14.1,22.35 14.1,22.34 Q2.3 ; 13.98,22.35 13.98,22.6 v1(13.21,23.37)
$2N875: length 21.1
  Inner1 w0.178: v1(15.49,22.35) 15.49,22.35 17.84,20 17.84,19.25 16.25,17.65 v1(11.43,17.65)
  Bottom Layer w0.178: v1(11.43,17.65) 11.43,16.64 11.56,16.51 D4.1
  Bottom Layer w0.254: v1(15.49,22.35) 15.49,22.68 Q2.1 17.46,23.3 R6.2 19.19,24.64 21.21,24.64 21.34,24.51 D5.1
$2N1939: length 2.5
  Bottom Layer w0.178: 2.92,17.03 2.92,17.27 1.56,18.63 1.27,18.63
$2N1957: length 1.9
  Bottom Layer w0.254: U11.5 4.59,17.01 4.57,17.03
$2N3420: length 1.3
  Bottom Layer w0.178: R25.1 U13.B1
$2N9095: length 2.1
  Bottom Layer w0.178: 9.97,8.66 7.84,8.66
$2N9100: length 2.1
  Bottom Layer w0.254: 9.97,11.66 7.84,11.66
$2N16866: length 10.5
  Bottom Layer w0.178: BUZZER1.2 13.3,5.56 12.8,5.56 12.19,4.95 12.19,2.16 12.94,1.41 Q4.3

## Copper pours and planes (outline as drawn; the poured copper is in the pictures)
3V3 on Top Layer: 15.27,12.45 13.97,12.45 13.97,17.17 15.62,18.82 15.62,13.72 15.23,13.72 15.23,12.48
3V3 on Top Layer: 22.61,2.92 21.1,2.92 21.1,14.39 22.61,14.39
3V3 on Top Layer: 19.48,19.94 19.62,19.79 19.62,14.39 18.53,14.39 18.53,19.02 18.56,19.02
3V3 on Top Layer: 20.15,26.55 22.86,29.26 22.86,36.7 22.1,37.47 19.18,37.47 19.05,37.34 19.05,34.85 21.62,34.85 21.97,34.5 21.97,30.61 21.08,29.72 21.08,28.02 19.88,26.81
3V3 on Bottom Layer: 27.56,37.21 29.21,37.21 29.21,35.18 27.56,35.18
3V3 on Bottom Layer: 10.8,33.66 10.8,34.92 11.05,35.18 18.07,35.18 18.07,30.39 13.19,30.39 13.19,33.41 12.95,33.66
3V3 on Bottom Layer: 19.18,37.21 20.7,37.21 20.7,35.05 19.18,35.05
3V3 on Bottom Layer: 14.22,12.32 21.69,12.32 22.61,13.23 22.61,15.82 21.33,13.46 19.2,13.46 19.2,13.84 14.22,13.84
3V3 on Inner2: 19.48,19.02 18.53,19.02 18.53,14.39 18.16,14.02 14.07,14.02 14.07,12.48 14.22,12.32 19.05,12.32 21.08,10.29 21.08,5.76 22.53,5.76 22.53,8.64 33.27,8.64 33.27,37.47 19.18,37.47 19.05,37.34 19.05,34.95 19.18,34.82 21.57,34.82 21.97,34.42 30.34,34.42 30.61,34.15 30.61,14.61 32,13.21 29.43,10.63 22.91,10.63 22.91,15.97 20.21,15.97 19.48,16.69
GND on Top Layer: 0,41.15 35.73,41.15 35.73,0 0,0
GND on Bottom Layer: 0,41.15 35.73,41.15 35.73,0 0,0
GND on Inner1: 0,41.15 35.73,41.15 35.73,0 0,0
GND on Inner2: 0,41.15 35.73,41.15 35.73,0 0,0
V33_CP2102 on Top Layer: 27.74,10.27 26.66,10.28 26.03,9.65 28.2,7.49 29.33,8.62 28.06,9.9 28.06,9.95 28.83,10.79 28.55,11.08
BAT on Bottom Layer: 13.21,22.1 11.18,22.1 11.18,25.53 12.57,25.53 13.22,26.22 13.22,27.42 12.95,27.69 11.94,27.69 11.7,27.92 11.7,29.36 12.59,29.36 12.59,27.98 13.55,27.98 13.55,29.36 14.45,29.36 14.45,27.31 16.14,27.31 16.19,27.26 16.19,25.62 13.64,25.62 13.21,25.15
BAT_DET on Bottom Layer: 16.12,25.44 13.54,25.44 13.54,23.18 14.15,23.18 16.12,24.59
BAT_IN on Bottom Layer: 8.64,18.67 8.64,20.83 8.51,20.95 8.51,22.22 11.02,22.22 11.02,27.56 6.36,27.56 6.36,21.17 6.89,21.17 8,20.07 8,18.67
BAT_PACK+ on Bottom Layer: 10.41,32.26 6.86,32.26 6.86,35.56 4.32,35.56 4.32,37.28 10.41,37.28 10.41,32.26
USB_VCC on Top Layer: 27.43,6.22 28.32,5.33 31.81,8.83 29.95,10.69 29.63,10.38 29.12,10.88 28.25,10.01 29.63,8.63 27.43,6.24
USB_VCC on Bottom Layer: 11.05,19.43 9.53,19.43 8,17.91 8,15.45 8.89,15.45 8.89,14.79 10.39,14.79 10.39,18.05 11.05,18.05
USB_VCC on Inner2: 8.88,16.13 10.8,16.13 10.8,11.3 9.11,11.3 9.11,8.13 10.6,8.13 10.6,6.88 7.24,6.88 7.24,13.51 8.88,13.51

## Text on the board
Bottom Silkscreen Layer: V1.0 | AMAIZE&BIN
